# EasyEDA schematic STM_bluepill_EasyEDA file.json
TITLE: Sheet_1; REV: 1.0; Date: 2026-08-30; Sheet: 1/1; Drawn By: mw3ndwaaa; Company: Your Company
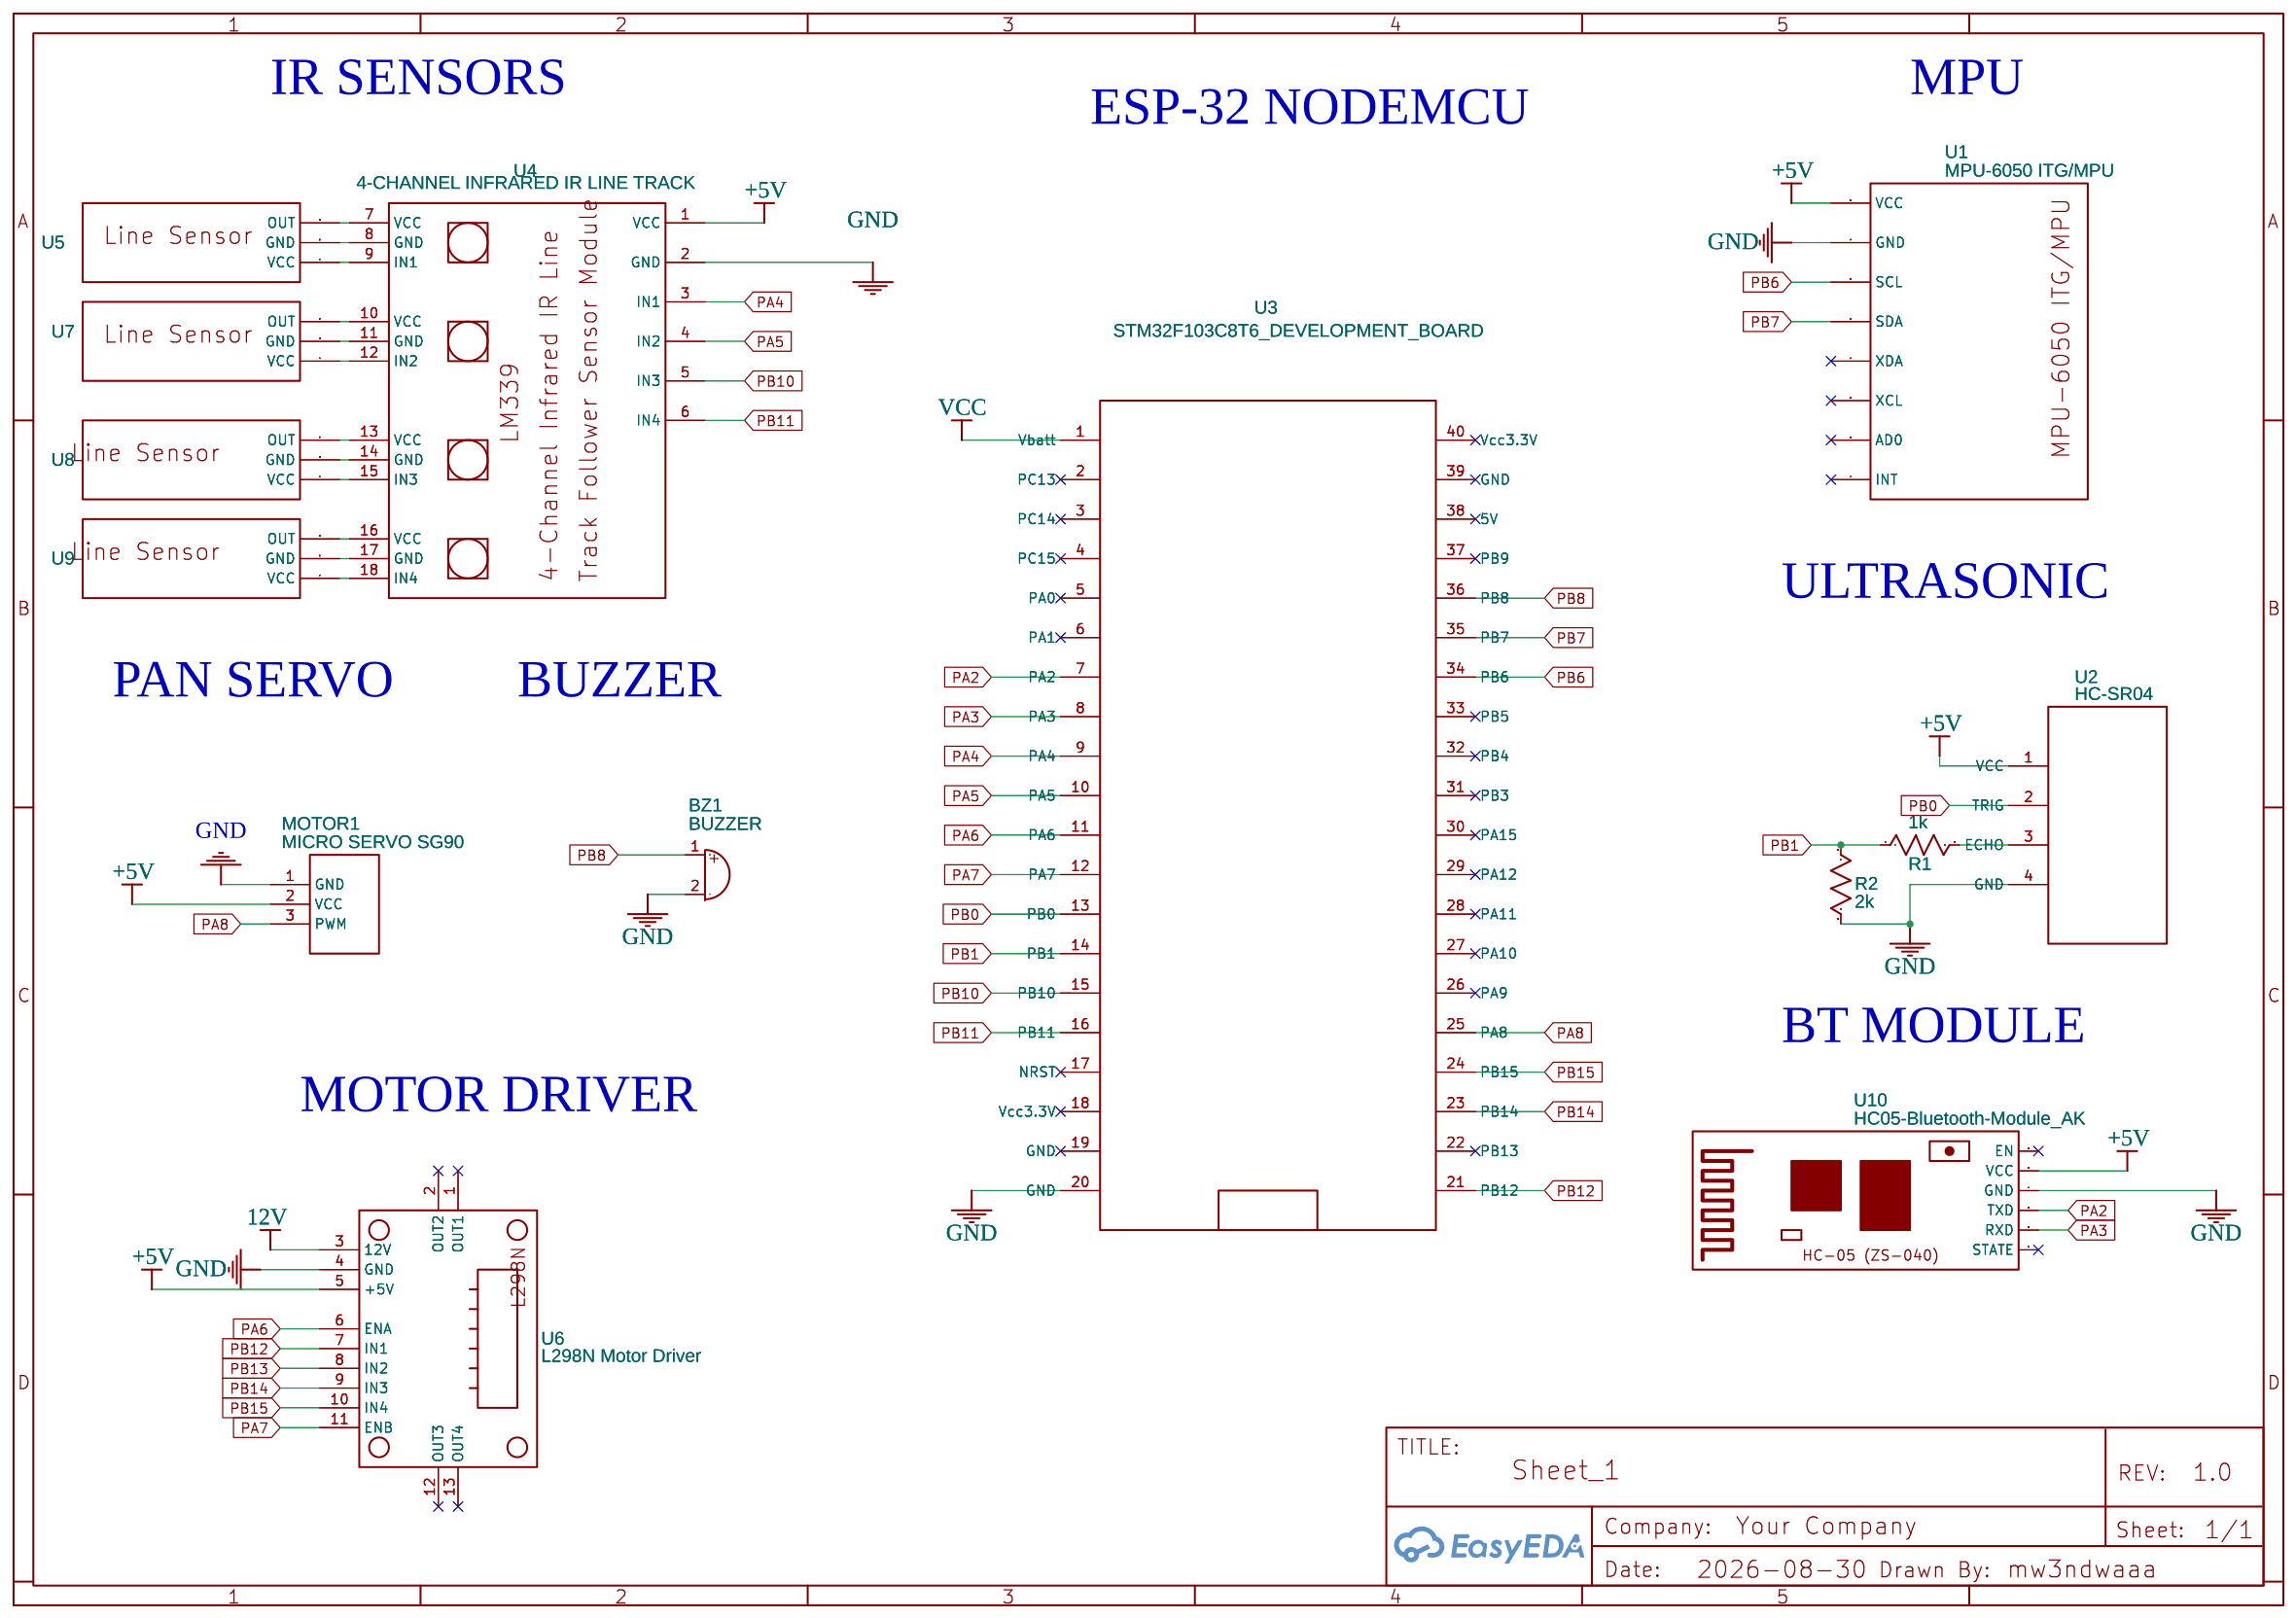
[diagram p0: schematic sheet]

## Parts
BZ1  BUZZER  [BUZZER_BEEPER:BUZZER_9X4MM]
MOTOR1  MICRO SERVO SG90  [MICRO SERVO SG90]
R1  1k  [R0603]
R2  2k  [R0603]
U1  MPU-6050 ITG/MPU  [MPU6050 ITG/MPU]
U2  HC-SR04  [HC_SR04]
U3  STM32F103C8T6_DEVELOPMENT_BOARD  [STM32F103C8T6-BLUEPILL]
U4  4-CHANNEL INFRARED IR LINE TRACK  [4-CHANNEL INFRARED IR LINE TRACK FOLLOWER SENSOR MODULE (LM339) COPY]
U5  MH-Sensor-Series Line Sensor  [MH-SENSOR-SERIES-LINE-SENSOR]
U6  L298N Motor Driver  [DRIVER L298N]
U7  MH-Sensor-Series Line Sensor  [MH-SENSOR-SERIES-LINE-SENSOR]
U8  MH-Sensor-Series Line Sensor  [MH-SENSOR-SERIES-LINE-SENSOR]
U9  MH-Sensor-Series Line Sensor  [MH-SENSOR-SERIES-LINE-SENSOR]
U10  HC05-Bluetooth-Module_AK  [HC05-BLUETOOTH-MODULE_AK]

## Library data of the parts
BZ1 = Device_Buzzer: Add into BOM: yes; Convert to PCB: yes; Origin Footprint: Buzzer_Beeper:Buzzer_12x9.5RM7.6; Contributor: jonathanjsuarez
MOTOR1 = MICRO SERVO SG90: Contributor: hoanx.iqqtech
R1 R2 = R_0603_US: Contributor: LCEDA_Lib
U1 = MPU-6050 ITG/MPU: Supplier: Bangood; Contributor: manarvink
U2 = HC-SR04: Contributor: fernando_l5
U3 = STM32F103C8T6_DEVELOPMENT_BOARD COPY COPY: Manufacturer Part: STM32Duino; Contributor: Johan_a
U4 = 4-CHANNEL INFRARED IR LINE TRACK FOLLOWER SENSOR MODULE (LM339) COPY: Manufacturer Part: LM339; Contributor: FelixBTG
U5 U7-U9 = MH-Sensor-Series Line Sensor: Contributor: eantis.prod
U6 = L298N Motor Driver: Contributor: Arne Josephus Morales
U10 = HC05-Bluetooth-Module_AK: Contributor: andrej.kanovsky

## Nets
12V: U6.3(12V)
+5V: MOTOR1.2(VCC) U1.0(VCC) U4.1(VCC) U6.5(+5V) U10.5(VCC)
GND: BZ1.2(-) MOTOR1.1(GND) R2.2 U1.1(GND) U4.2(GND) U6.4(GND) U10.4(GND)
PA2: U10.3(TXD)
PA3: U10.2(RXD)
PA4: U4.3(IN1)
PA5: U4.4(IN2)
PA6: U6.6(ENA)
PA7: U6.11(ENB)
PA8: MOTOR1.3(PWM)
PB1: R1.1 R2.1
PB6: U1.2(SCL)
PB7: U1.3(SDA)
PB8: BZ1.1(+)
PB10: U4.5(IN3)
PB11: U4.6(IN4)
PB12: U6.7(IN1)
PB13: U6.8(IN2)
PB14: U6.9(IN3)
PB15: U6.10(IN4)
Net-(U4-7): U4.7(VCC) U5.2(OUT)
Net-(U4-8): U4.8(GND) U5.3(GND)
Net-(U4-9): U4.9(IN1) U5.4(VCC)
Net-(U4-10): U4.10(VCC) U7.2(OUT)
Net-(U4-11): U4.11(GND) U7.3(GND)
Net-(U4-12): U4.12(IN2) U7.4(VCC)
Net-(U4-13): U4.13(VCC) U8.2(OUT)
Net-(U4-14): U4.14(GND) U8.3(GND)
Net-(U4-15): U4.15(IN3) U8.4(VCC)
Net-(U4-16): U4.16(VCC) U9.2(OUT)
Net-(U4-17): U4.17(GND) U9.3(GND)
Net-(U4-18): U4.18(IN4) U9.4(VCC)

Not connected (* = marked no-connect by the designer): R1 2; U1 4(XDA)* 5(XCL)* 6(AD0)* 7(INT)*; U2 1(VCC) 2(TRIG) 3(ECHO) 4(GND); U3 1(Vbatt) 2(PC13) 3(PC14) 4(PC15) 5(PA0) 6(PA1) 7(PA2) 8(PA3) 9(PA4) 10(PA5) 11(PA6) 12(PA7) 13(PB0) 14(PB1) 15(PB10) 16(PB11) 17(NRST) 18(Vcc3.3V) 19(GND) 20(GND) 21(PB12) 22(PB13) 23(PB14) 24(PB15) 25(PA8) 26(PA9) 27(PA10) 28(PA11) 29(PA12) 30(PA15) 31(PB3) 32(PB4) 33(PB5) 34(PB6) 35(PB7) 36(PB8) 37(PB9) 38(5V) 39(GND) 40(Vcc3.3V); U6 1(OUT1)* 2(OUT2)* 12(OUT3)* 13(OUT4)*; U10 1(STATE)* 6(EN)*

## Notes on the sheet
- IR SENSORS
- MPU
- ESP-32 NODEMCU
- ULTRASONIC
- PAN SERVO
- BUZZER
- BT MODULE
- MOTOR DRIVER
